# Altium schematic sheet 02-UART.SchDoc: UART
size A; Revision: A; SheetNumber: 2; SheetTotal: 10; ApprovedDate: 04/02/2019; AssemblyNumber: ECE315-F19; ECE315_Project_Name: ECE353 F23 Wack-A-Mole
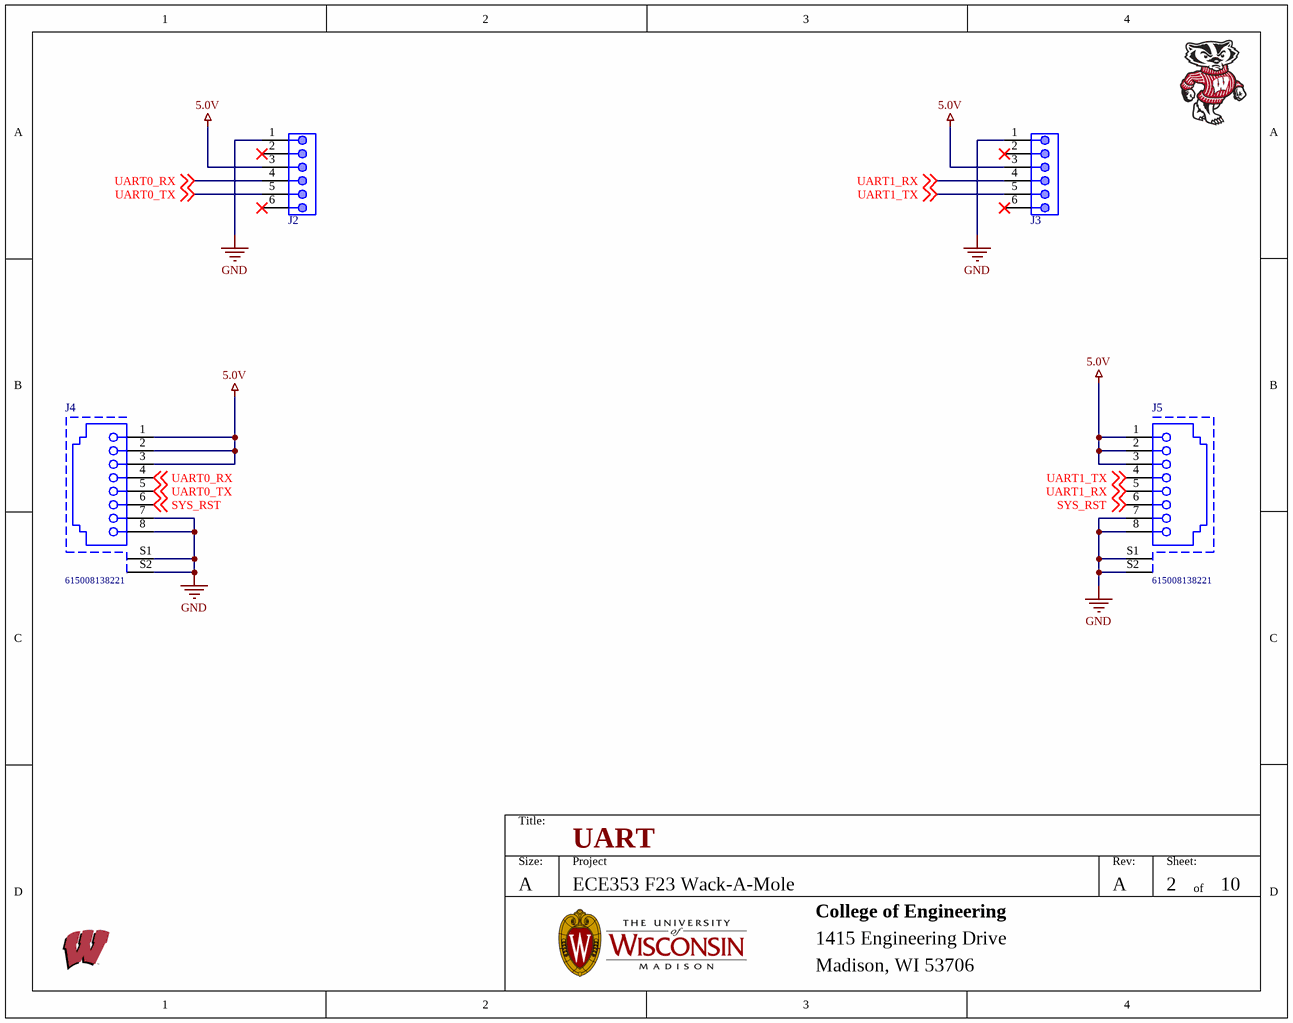
[diagram p0: 02-UART.SchDoc]

## Parts
J2  (no value)  [HDR1X6]
J3  (no value)  [HDR1X6]
J4  615008138221  [615008138221]
J5  615008138221  [615008138221]

## Nets
5.0V: J2.3 J3.3 J4.1 J4.2 J4.3 J5.1 J5.2 J5.3
GND: J2.1 J3.1 J4.7 J4.8 J4.S1 J4.S2 J5.7 J5.8 J5.S1 J5.S2
SYS_RST: J4.6 J5.6 ; off-sheet SYS_RST
UART0_RX: J2.4 J4.4 ; off-sheet UART0_RX
UART0_TX: J2.5 J4.5 ; off-sheet UART0_TX
UART1_RX: J3.4 J5.5 ; off-sheet UART1_RX
UART1_TX: J3.5 J5.4 ; off-sheet UART1_TX

Not connected (* = marked no-connect by the designer): J2 2* 6*; J3 2* 6*

## Notes on the sheet
- Title:
- Size:
- A
- Project
- Rev:
- Sheet:
- of
- College of Engineering
- 1415 Engineering Drive
- Madison, WI 53706

## Library data of the parts
J2 J3 = CONN_HEADER_MALE_1x6: Female, 6C, Rt Angle, .100"CC; 3.15mm Tail, No Mounting; PBT, Phos. Bronze, 105 C; Manufacturer 1: Sullins; Manufacturer Part Number 1: PPPC061LGBN-RC; Number of Positions: 6; Connector Type: Header; Pitch: 0.1inch; Voltage Rating: 250V; Supplier 1: Digi-Key; Supplier Part Number 1: S5481-ND; RoHS: Yes; Category: Connectors; Stock 1: 12284; Pricing 1: 1=0.66, 10=0.56, 80=0.50288, 440=0.41148, 1000=0.36576, 5000=0.3302 (USD); Mount: Through Hole; Color: Black; Contact Plating: Gold; Contact Material: Bronze; Housing Color: Black; Housing Material: Plastic; Package Quantity: 1000; Number of Rows: 1; Packaging: Bulk; Termination: Solder; Contact Type: Female Socket; Length: 15.7mm; Width: 8.5mm; Height: 2.4mm; Lead Free: Lead Free; RoHS Compliant: Yes; ComponentLink1URL: https://media.digikey.com/pdf/Data%20Sheets/Sullins%20PDFs/Female_Headers.100_DS.pdf?src-supplier=Digi-Key; ComponentLink1Description: https://media.digikey.com/pdf/Data%20Sheets/Sullins%20PDFs/Female_Headers.100_DS.pdf?src-supplier=Digi-Key; ComponentLink2URL: http://www.sullinscorp.com/catalogs/78_Page80-81_HEADER_.100_2.54mm_FEMALE.pdf?src-supplier=Future+Electronics; ComponentLink2Description: http://www.sullinscorp.com/catalogs/78_Page80-81_HEADER_.100_2.54mm_FEMALE.pdf?src-supplier=Future+Electronics; Contact Finish - Mating: GOLD; Insulation Color: Black; Insulation Material: Polyester; Contact Shape: Square; Min Operating Temperature: -40°C; Max Operating Temperature: 105°C; Fastening Type: Pull; Series: -; Flammability Rating: UL94 V-0
J4 J5 = CMP-1502-01731-1: Modular Jack WR-MJ, Front Post, Shielded, Vertical Entry, THT, 8P8C; Manufacturer: Wurth Elektronik; Rated Current: 1.5A; Withstanding Voltage: 1000VAC; Working Voltage: 120VAC; Port: 1x1; Compliance: Leadfree/RoHS; Contact Resistance: 20mOhm; Publisher: WurthElektronik; Packaging: Tray; Manufacturer URL: http://www.we-online.de; Operating Temperature: -40to85degC; Package Reference: 615008138221; Mounting Technology: THT; Part Number: 615008138221; Datasheet URL: https://katalog.we-online.com/em/datasheet/615008138221.pdf; Pin Number: 8P8C; Entrance: Vertical